# EAGLE design amp_interface2_v_1_0 (EAGLE 6.4)
PyRadio
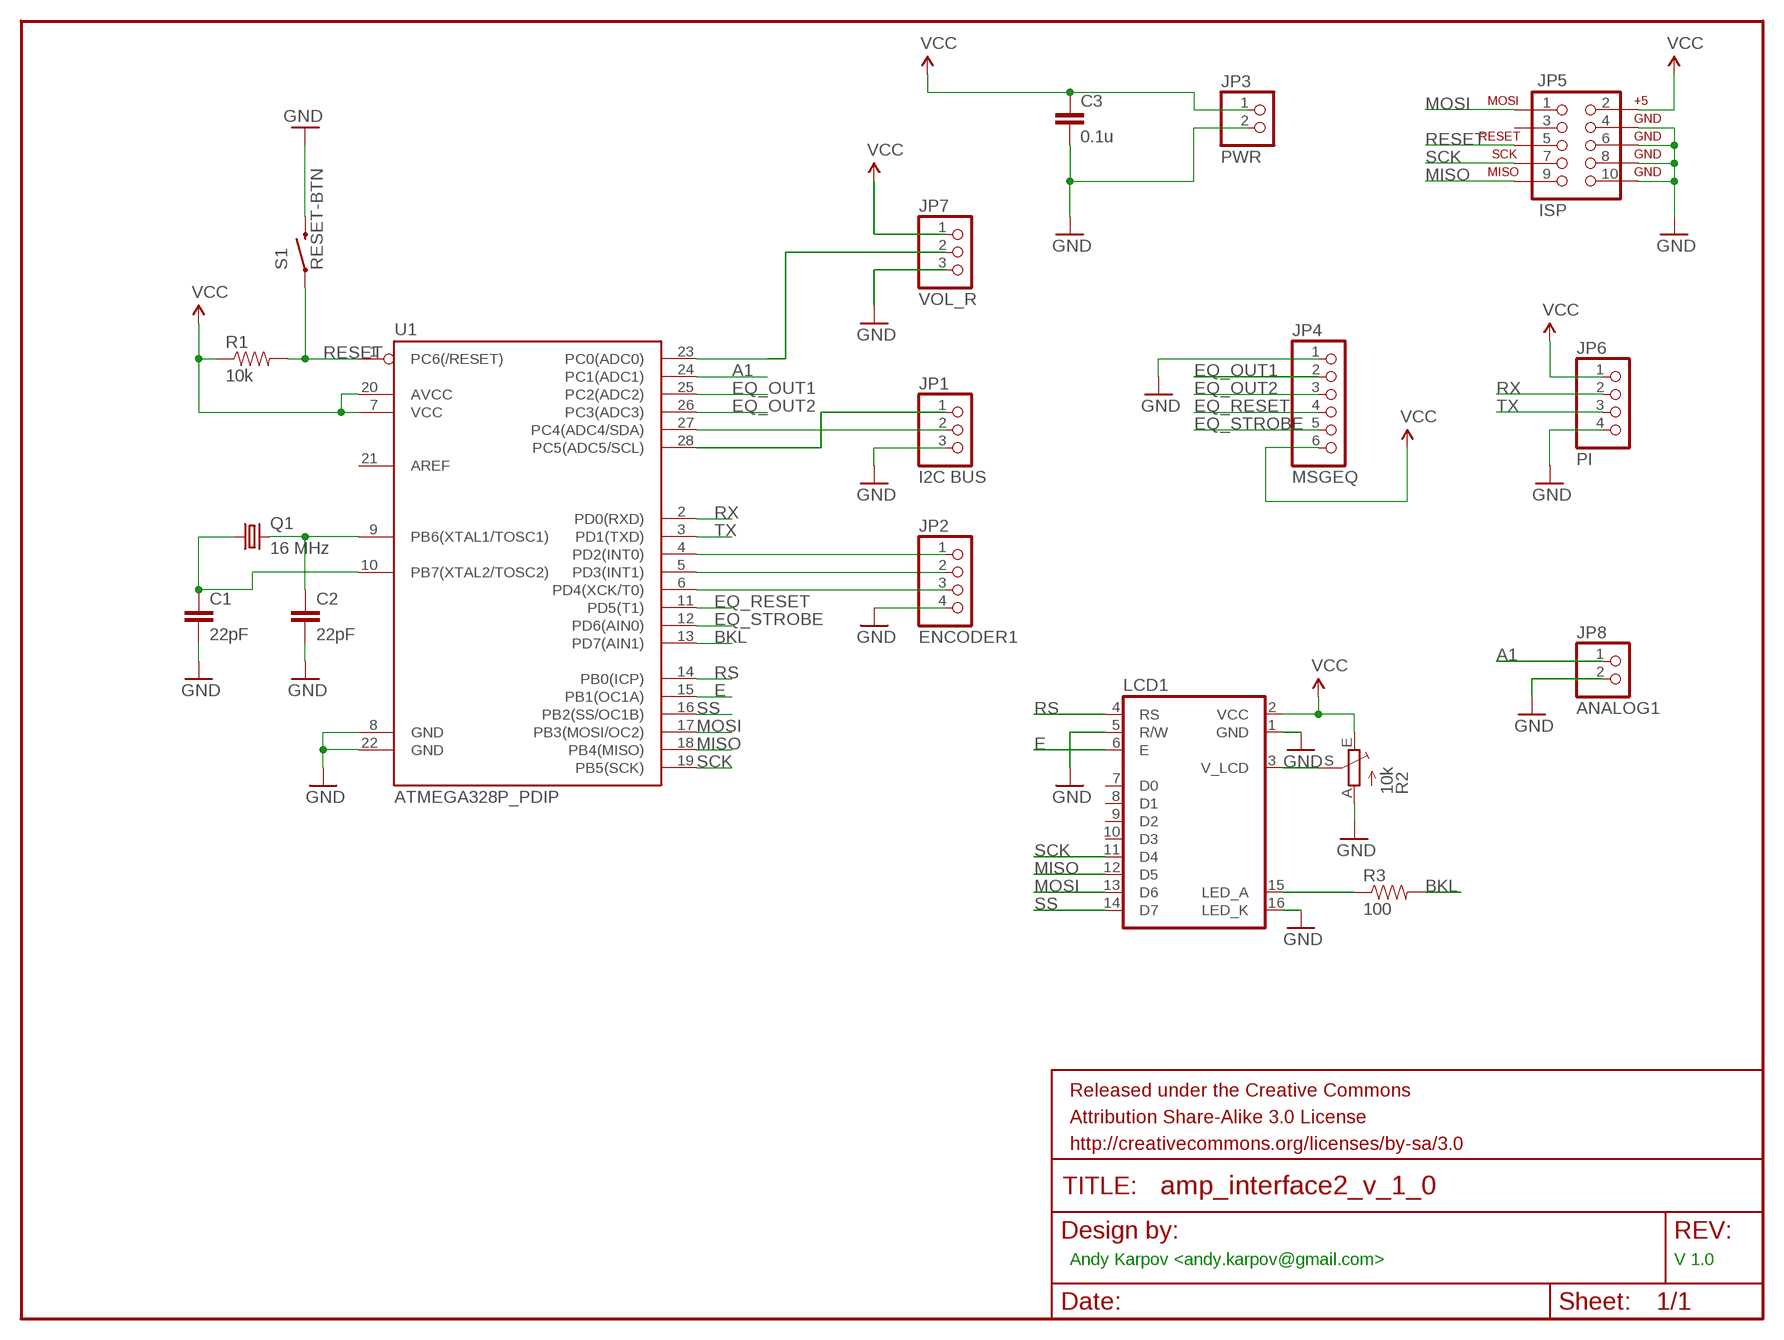
[diagram p0: schematic, sheet 1]

## Parts
C1  22pF  CAPPTH2  [CAP-PTH-SMALL2]
C2  22pF  CAPPTH2  [CAP-PTH-SMALL2]
C3  0.1u  CAPPTH2  [CAP-PTH-SMALL2]
FRAME1  FRAME-LETTER  [CREATIVE_COMMONS]
JP1  I2C BUS  PINHD-1X3  [1X03]
JP2  ENCODER1  PINHD-1X4  [1X04]
JP3  PWR  PINHD-1X2  [1X02]
JP4  MSGEQ  PINHD-1X6  [1X06]
JP5  ISP  AVR_SPI_PROG2PTH2  [2X5-SHROUDED]
JP6  PI  PINHD-1X4  [1X04]
JP7  VOL_R  PINHD-1X3  [1X03]
JP8  ANALOG1  PINHD-1X2  [1X02]
LCD1  LCD-4X20  [LCD-4X20]
Q1  16 MHz  CRYSTALHC49S  [HC49/S]
R1  10k  RESISTORPTH-1/4W  [AXIAL-0.4]
R2  10k  TRIM_EU-B64Y  [B64Y]
R3  100  RESISTORPTH-1/2W  [AXIAL-0.5]
S1  RESET-BTN  SWITCH-MOMENTARY-2PTH  [TACTILE-PTH]
U1  ATMEGA328P_PDIP  [DIL28-3]

## Nets
A1: JP8.1 U1.24(PC1(ADC1))
BKL: R3.P$2 U1.13(PD7(AIN1))
E: LCD1.6(E) U1.15(PB1(OC1A))
EQ_OUT1: JP4.2 U1.25(PC2(ADC2))
EQ_OUT2: JP4.3 U1.26(PC3(ADC3))
EQ_RESET: JP4.4 U1.11(PD5(T1))
EQ_STROBE: JP4.5 U1.12(PD6(AIN0))
GND: C1.2 C2.2 C3.2 JP1.3 JP2.4 JP3.2 JP4.1 JP5.4 JP5.6 JP5.8 JP5.10 JP6.4 JP7.3 JP8.2 LCD1.1(GND) LCD1.5(R/W) LCD1.16(LED_K) R2.A S1.3 U1.8(GND) U1.22(GND)
MISO: JP5.9 LCD1.12(D5) U1.18(PB4(MISO))
MOSI: JP5.1 LCD1.13(D6) U1.17(PB3(MOSI/OC2))
N$1: C2.1 Q1.2 U1.9(PB6(XTAL1/TOSC1))
N$2: C1.1 Q1.1 U1.10(PB7(XTAL2/TOSC2))
N$3: LCD1.3(V_LCD) R2.S
N$6: JP1.2 U1.27(PC4(ADC4/SDA))
N$7: JP1.1 U1.28(PC5(ADC5/SCL))
N$13: LCD1.15(LED_A) R3.P$1
N$20: JP2.3 U1.6(PD4(XCK/T0))
N$21: JP2.1 U1.4(PD2(INT0))
N$24: JP2.2 U1.5(PD3(INT1))
PC0: JP7.2 U1.23(PC0(ADC0))
RESET: JP5.5 R1.P$2 S1.1 U1.1(PC6(/RESET))
RS: LCD1.4(RS) U1.14(PB0(ICP))
RX: JP6.2 U1.2(PD0(RXD))
SCK: JP5.7 LCD1.11(D4) U1.19(PB5(SCK))
SS: LCD1.14(D7) U1.16(PB2(SS/OC1B))
TX: JP6.3 U1.3(PD1(TXD))
VCC: C3.1 JP3.1 JP4.6 JP5.2 JP6.1 JP7.1 R1.P$1 R2.E U1.7(VCC) U1.20(AVCC)
Unconnected: JP5.3 LCD1.7(D0) LCD1.8(D1) LCD1.9(D2) LCD1.10(D3) U1.21(AREF)

## Notes on the sheet
- Andy Karpov <andy.karpov@gmail.com> | V 1.0

## Power pins joined to a net without a drawn wire
VCC: LCD1.2(VCC)

## Library data of the parts
C1-C3 = SparkFun-Passives:CAP: Capacitor Standard 0603 ceramic capacitor, and 0.1" leaded capacitor.
FRAME1 = SparkFun-Aesthetics:FRAME-LETTER: Schematic Frame Standard 8.5x11 US Letter frame
JP1 JP7 = pinhead:PINHD-1X3: PIN HEADER
JP2 JP6 = pinhead:PINHD-1X4: PIN HEADER
JP3 JP8 = pinhead:PINHD-1X2: PIN HEADER
JP4 = pinhead:PINHD-1X6: PIN HEADER
JP5 = SparkFun-Connectors:AVR_SPI_PROG2: AVR 10-pin ICSP Header This is the standard AVR In Circuit Serial Programming header. Minimal, but includes pin one indicator. Works with standard Olimex programmers. Also look for the 6-pin reduced version. Spark Fun Electronics SKU: PRT-00778
LCD1 = oli:LCD-4X20: LCD 4 x 20 Characters
Q1 = crystal_mod:CRYSTAL: CRYSTAL; OC_FARNELL: 1667008; OC_NEWARK: unknown
R1 R3 = SparkFun-Passives:RESISTOR: Resistor Basic schematic elements and footprints for 0603, 1206, and PTH resistors.
R2 = pot:TRIM_EU-: POTENTIOMETER
S1 = SparkFun-Electromechanical:SWITCH-MOMENTARY-2: Various NO switches- pushbuttons, reed, etc
U1 = SparkFun-DigitalIC:ATMEGA328P_PDIP: uC used in the Arduino 32kb flash, 1k EEPROM, 2k SRAM This is the through-hole version of this chip.

## Board
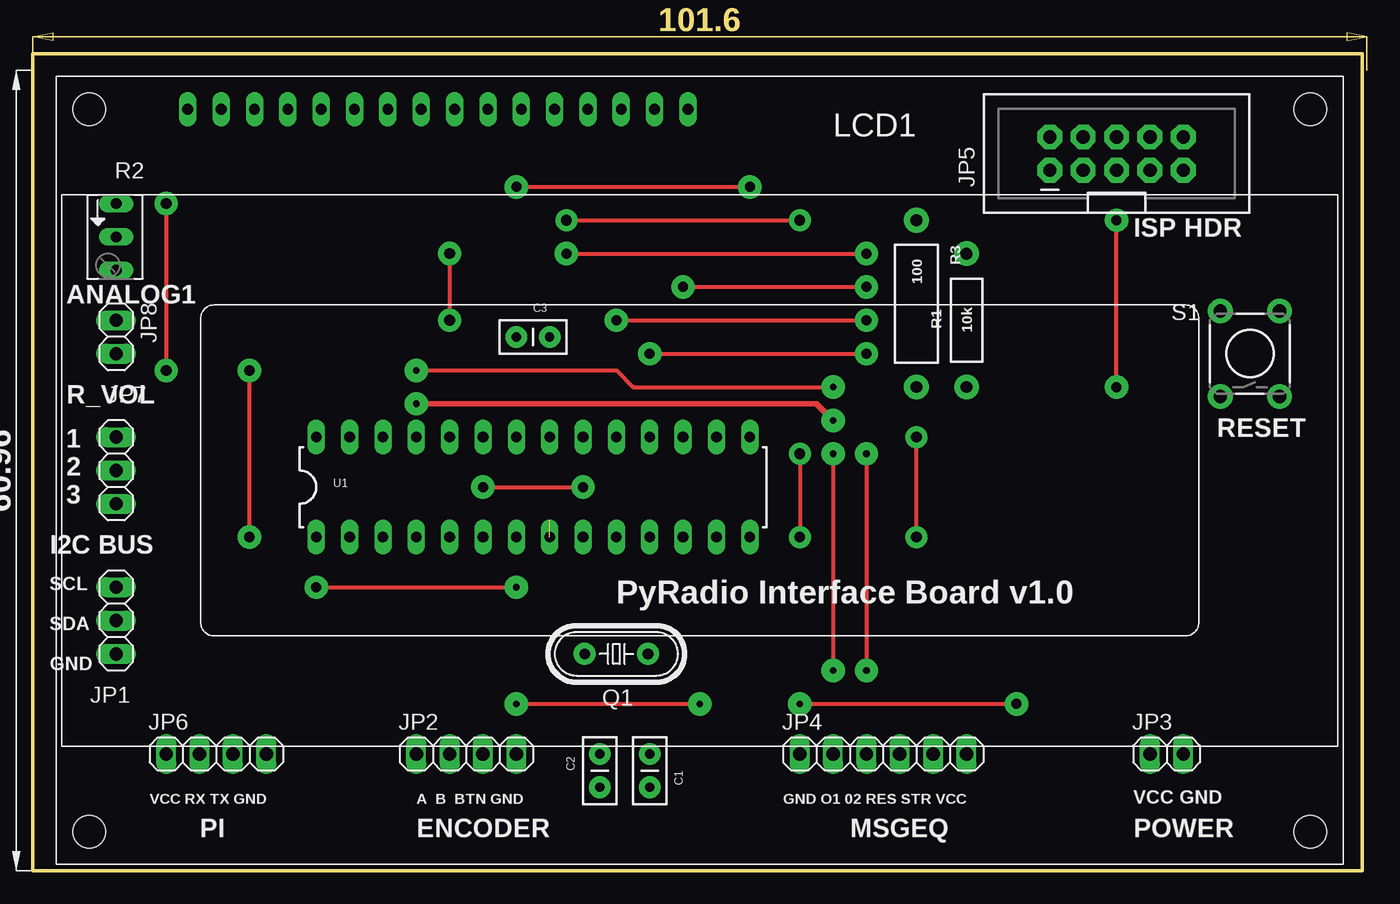
[diagram p1: board, top side]
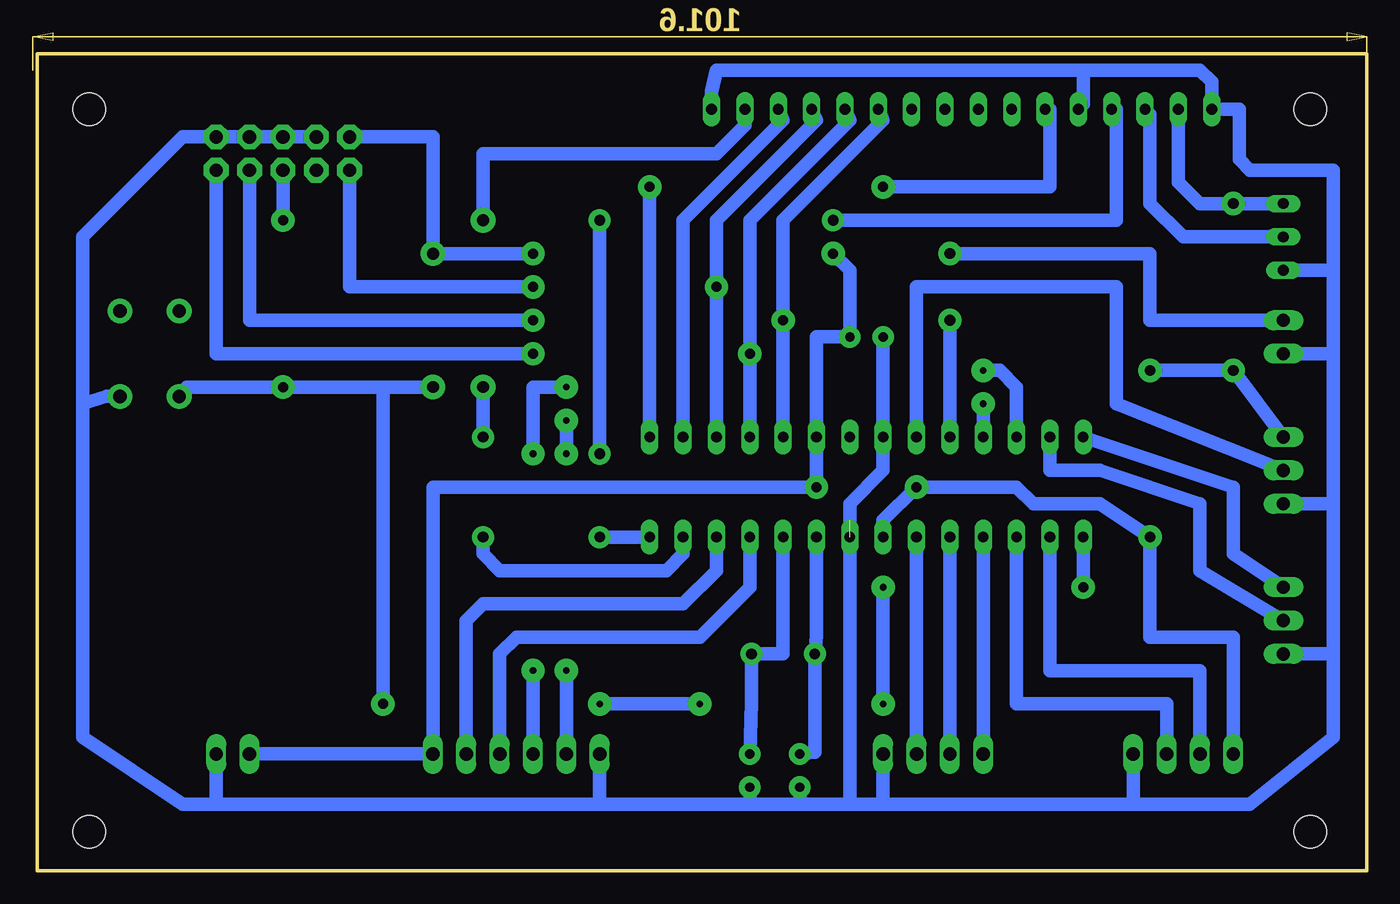
[diagram p2: board, bottom side, seen from below]

Size 101.27 x 62.22 mm. Coordinates in mm from the lower left corner, seen from the top.
Outline: 0,0 101.27,0 101.27,62.22 0,62.22 0,0
Copper layers (1*16): Top 0.035mm / dielectric 1.5mm / Bottom 0.035mm
Design rules "default": minimum track width 10mil, minimum drill 24mil, track to track 8mil, track to pad 8mil, pad to pad 8mil, via to via 8mil, smd to smd 8mil, copper to edge 40mil, drill to drill 8mil, minimum pad ring 10mil, minimum via ring 8mil, stop-mask expansion 4mil, vias tented up to drill 0mil, thermal gap 10mil

### Footprints (pad centres in the part's own frame; a part is rotated, then mirrored left to right if it is on the bottom)
CAP-PTH-SMALL2 = drill 0.7 pad 1.651: 1 0,0; 2 2.54,0
1X03 = drill 1.016 long: 1 -2.54,0; 2 0,0; 3 2.54,0
1X04 = drill 1.016 long: 1 -3.81,0; 2 -1.27,0; 3 1.27,0; 4 3.81,0
1X02 = drill 1.016 long: 1 -1.27,0; 2 1.27,0
1X06 = drill 1.016 long: 1 -6.35,0; 2 -3.81,0; 3 -1.27,0; 4 1.27,0; 5 3.81,0; 6 6.35,0
2X5-SHROUDED = drill 1.016 pad 1.88 octagon: 1 -1.27,5.08; 2 1.27,5.08; 3 -1.27,2.54; 4 1.27,2.54; 5 -1.27,0; 6 1.27,0; 7 -1.27,-2.54; 8 1.27,-2.54; 9 -1.27,-5.08; 10 1.27,-5.08
LCD-4X20 = drill 0.813 long: 1 -39,27.5; 2 -36.46,27.5; 3 -33.92,27.5; 4 -31.38,27.5; 5 -28.84,27.5; 6 -26.3,27.5; 7 -23.76,27.5; 8 -21.22,27.5; 9 -18.68,27.5; 10 -16.14,27.5; 11 -13.6,27.5; 12 -11.06,27.5; 13 -8.52,27.5; 14 -5.98,27.5; 15 -3.44,27.5; 16 -0.9,27.5 | hole 2.5: -46.5,-27.5; -46.5,27.5; 46.5,27.5; 46.5,-27.5
HC49/S = drill 0.813 pad 1.676: 1 -2.413,0; 2 2.413,0
AXIAL-0.4 = drill 0.9 pad 1.88: P$1 -5.08,0; P$2 5.08,0
B64Y = drill 0.813 long: A 2.54,0; E -2.54,0; S 0,0
AXIAL-0.5 = drill 0.9 pad 1.88: P$1 -6.35,0; P$2 6.35,0
TACTILE-PTH = drill 1.016 pad 1.88: 1 -3.251,2.261; 2 3.251,2.261; 3 -3.251,-2.261; 4 3.251,-2.261
DIL28-3 = drill 0.813 long: 1 -16.51,-3.81; 2 -13.97,-3.81; 3 -11.43,-3.81; 4 -8.89,-3.81; 5 -6.35,-3.81; 6 -3.81,-3.81; 7 -1.27,-3.81; 8 1.27,-3.81; 9 3.81,-3.81; 10 6.35,-3.81; 11 8.89,-3.81; 12 11.43,-3.81; 13 13.97,-3.81; 14 16.51,-3.81; 15 16.51,3.81; 16 13.97,3.81; 17 11.43,3.81; 18 8.89,3.81; 19 6.35,3.81; 20 3.81,3.81; 21 1.27,3.81; 22 -1.27,3.81; 23 -3.81,3.81; 24 -6.35,3.81; 25 -8.89,3.81; 26 -11.43,3.81; 27 -13.97,3.81; 28 -16.51,3.81

### Placement (x,y rotation side)
C1  46.99,8.89 270 top
C2  43.18,8.89 270 top
C3  39.37,40.64 180 top
FRAME1  20.32,63.5 0 top
JP1  6.35,19.05 270 top
JP2  33.02,8.89 0 top
JP3  86.36,8.89 0 top
JP4  64.77,8.89 0 top
JP5  82.55,54.61 90 top
JP6  13.97,8.89 0 top
JP7  6.35,30.48 270 top
JP8  6.35,40.64 270 top
LCD1  50.8,30.48 0 top
Q1  44.45,16.51 180 top
R1  71.12,41.91 270 top
R2  6.35,48.26 270 top
R3  67.31,43.18 270 top
S1  92.71,39.37 90 top
U1  38.1,29.21 0 top

### Tracks (layer width: path | path; a pad name or v marks a point on that pad's centre or on a via)
A1  (via drill 0.81 pad 1.78)
  Top 0.305: v31.75,46.99 v31.75,41.91
  Bottom 1.016: JP8.1 16.51,41.91 16.51,46.99 v31.75,46.99 | U1.24 v31.75,41.91
BKL  (via drill 0.81 pad 1.68)
  Top 0.305: v67.31,25.4 v67.31,33.02
  Bottom 1.016: U1.13 52.07,24.13 53.34,22.86 66.04,22.86 67.31,24.13 v67.31,25.4 | R3.P$2 v67.31,33.02
E  (via drill 0.76 pad 1.78)
  Top 0.305: v36.83,52.07 v54.61,52.07
  Bottom 1.016: v54.61,52.07 U1.15 | LCD1.6 24.13,57.98 24.13,52.07 v36.83,52.07
EQ_OUT1  (via drill 0.51 pad 1.78)
  Top 0.305: v60.96,31.75 v60.96,15.24
  Top 0.406: v29.21,35.56 59.69,35.56 v60.96,34.29
  Bottom 1.016: JP4.2 v60.96,15.24 | U1.25 v29.21,35.56 | v60.96,34.29 v60.96,31.75
EQ_OUT2  (via drill 0.51 pad 1.78)
  Top 0.305: v63.5,31.75 v63.5,15.24 | v29.21,38.1 44.45,38.1 45.72,36.83 v60.96,36.83
  Bottom 1.016: JP4.3 v63.5,15.24 | U1.26 26.67,36.83 27.94,38.1 v29.21,38.1 | v60.96,36.83 63.5,36.83 v63.5,31.75
EQ_RESET
  Bottom 1.016: U1.11 46.99,21.59 50.8,17.78 64.77,17.78 66.04,16.51 JP4.4
EQ_STROBE
  Bottom 1.016: U1.12 49.53,22.86 52.07,20.32 67.31,20.32 68.58,19.05 JP4.5
GND  (1 unrouted)
  Bottom 1.016: 39.37,26.67 39.37,27.94 36.83,30.48 U1.22 C3.2 | JP5.10 JP5.8 JP5.6 JP5.4 JP5.10 | 2.54,16.51 2.54,10.16 8.89,5.08 17.78,5.08 | 2.54,16.51 2.54,27.94 | 2.54,27.94 2.54,39.37 | 2.54,39.37 2.54,45.72 | 2.54,45.72 2.54,53.34 8.89,53.34 9.72,54.17 9.72,57.98 LCD1.1 11.8,60.06 12.7,60.96 21.59,60.96 | JP7.3 2.54,27.94 | 17.78,5.08 JP6.4 | JP3.2 87.63,5.08 | 87.63,5.08 58.42,5.08 | 58.42,5.08 46.99,5.08 | 87.63,5.08 90.17,5.08 97.79,10.16 97.79,35.56 | 21.59,60.96 21.59,58.35 LCD1.5 | LCD1.16 49.9,59.32 49.53,60.96 21.59,60.96 | 17.78,5.08 36.83,5.08 | 36.83,5.08 39.37,5.08 | 39.37,5.08 43.18,5.08 | 43.18,5.08 46.99,5.08 | JP2.4 36.83,5.08 | R2.A 2.54,45.72 | C2.2 43.18,5.08 | C1.2 46.99,5.08 | U1.8 39.37,5.08 | JP5.10 90.17,55.88 97.79,48.26 97.79,35.56 | S1.3 95.96,36.12 97.79,35.56 | JP4.1 58.42,5.08 | JP8.2 2.54,39.37 | JP1.3 2.54,16.51
MISO  (via drill 0.76 pad 1.78)
  Top 0.305: v46.99,39.37 v63.5,39.37
  Bottom 1.016: U1.18 v46.99,39.37 46.99,49.53 39.37,57.15 LCD1.12 | JP5.9 87.63,39.37 v63.5,39.37
MOSI  (via drill 0.76 pad 1.78)
  Top 0.305: v49.53,44.45 v63.5,44.45
  Bottom 1.016: U1.17 v49.53,44.45 49.53,49.53 41.91,57.15 LCD1.13 | v63.5,44.45 77.47,44.45 JP5.1
N$1
  Bottom 1.016: U1.9 41.91,17.91 Q1.2 42.04,9.02 C2.1
N$2
  Bottom 1.016: U1.10 44.45,16.51 Q1.1 46.86,12.83 C1.1
N$3
  Bottom 1.016: R2.S 13.97,48.26 16.51,50.8 16.51,57.61 LCD1.3
N$6
  Bottom 1.016: U1.27 24.13,30.48 20.32,30.48 12.7,27.94 12.7,22.86 JP1.2
N$7
  Bottom 1.016: U1.28 10.16,29.21 10.16,24.13 JP1.1
N$13
  Bottom 1.016: LCD1.15 47.36,56.78 49.53,54.61 67.31,54.61 R3.P$1
N$20
  Bottom 1.016: U1.6 JP2.3
N$21
  Bottom 1.016: U1.4 JP2.1
N$24
  Bottom 1.016: U1.5 JP2.2
PC0
  Bottom 1.016: JP7.2 19.05,35.56 19.05,44.45 34.29,44.45 U1.23
RESET  (via drill 0.51 pad 1.78, 0.76 pad 1.78)
  Top 0.305: v82.55,36.83 v82.55,49.53 | v21.59,21.59 v36.83,21.59 | v36.83,12.7 v50.8,12.7 | v58.42,12.7 v74.93,12.7
  Bottom 1.016: U1.1 v21.59,21.59 | R1.P$2 74.93,36.83 | 74.93,36.83 v82.55,36.83 89.89,36.83 S1.1 | JP5.5 v82.55,49.53 | v74.93,12.7 74.93,36.83 | v36.83,21.59 v36.83,12.7 | v50.8,12.7 v58.42,12.7
RS  (via drill 0.81 pad 1.68)
  Top 0.305: v40.64,49.53 v58.42,49.53 | v58.42,31.75 v58.42,25.4
  Bottom 1.016: LCD1.4 19.05,57.98 19.05,49.53 v40.64,49.53 | v58.42,49.53 v58.42,31.75 | v58.42,25.4 U1.14
RX
  Bottom 1.016: U1.2 24.13,15.24 12.7,15.24 JP6.2
SCK  (via drill 0.76 pad 1.78)
  Top 0.305: v44.45,41.91 v63.5,41.91
  Bottom 1.016: U1.19 v44.45,41.91 44.45,49.53 36.83,57.15 LCD1.11 | JP5.7 85.09,41.91 v63.5,41.91
SS
  Bottom 1.016: U1.16 52.07,48.26 52.07,49.53 44.45,57.15 LCD1.14
TX
  Bottom 1.016: U1.3 26.67,12.7 15.24,12.7 JP6.3
VCC  (via drill 0.76 pad 1.78, 0.81 pad 1.78)
  Top 0.305: v40.64,46.99 v63.5,46.99 | v34.29,29.21 v41.91,29.21 | v10.16,50.8 v10.16,38.1 | v16.51,25.4 v16.51,38.1
  Bottom 1.016: v40.64,46.99 39.37,45.72 C3.1 41.91,40.64 U1.20 v41.91,29.21 71.12,29.21 JP4.6 JP3.1 | R2.E v10.16,50.8 12.7,50.8 14.34,52.44 LCD1.2 | U1.7 36.83,26.67 v34.29,29.21 26.67,29.21 25.4,27.94 20.32,27.94 v16.51,25.4 16.51,17.78 10.16,17.78 JP6.1 | v63.5,46.99 R1.P$1 71.12,55.88 JP5.2 | JP7.1 v10.16,38.1 v16.51,38.1

### Text on the board
tPlace: ISP HDR | ANALOG1 | R_VOL | RESET | 1 / 2 / 3 | I2C BUS | PyRadio Interface Board v1.0 | SCL / / SDA / / GND | VCC RX TX GND | A B BTN GND | GND O1 02 RES STR VCC | VCC GND | PI | ENCODER | MSGEQ | POWER